# EAGLE design thermometer (EAGLE 5.12)
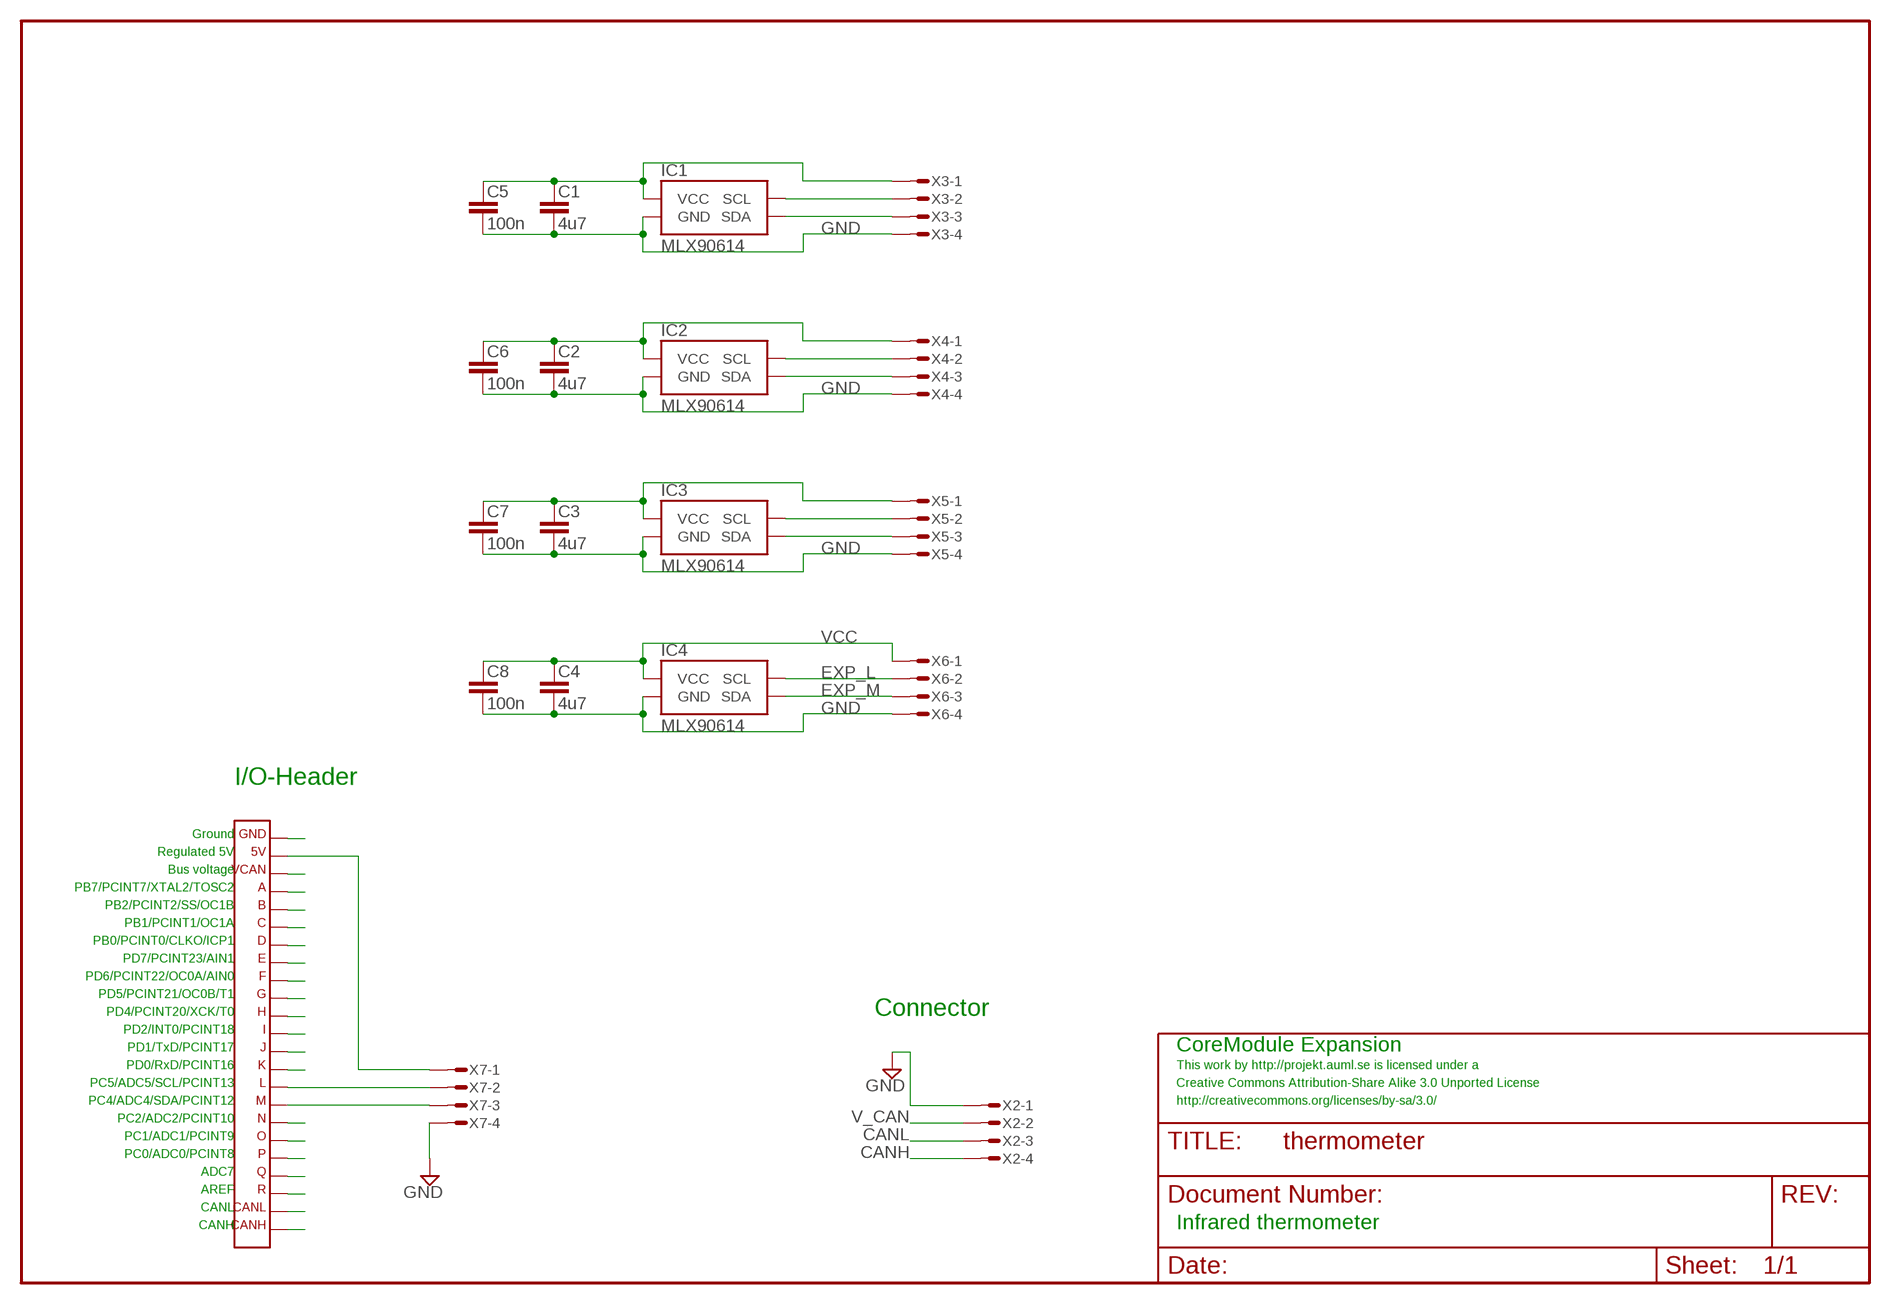
[diagram p0: schematic, sheet 1]

## Parts
C1  4u7  C-EUC0805  [C0805]
C2  4u7  C-EUC0805  [C0805]
C3  4u7  C-EUC0805  [C0805]
C4  4u7  C-EUC0805  [C0805]
C5  100n  C-EUC0603  [C0603]
C6  100n  C-EUC0603  [C0603]
C7  100n  C-EUC0603  [C0603]
C8  100n  C-EUC0603  [C0603]
IC1  MLX90614  MLX90614T=-39-4  [TO-39-4]
IC2  MLX90614  MLX90614T=-39-4  [TO-39-4]
IC3  MLX90614  MLX90614T=-39-4  [TO-39-4]
IC4  MLX90614  MLX90614T=-39-4  [TO-39-4]
X1  CORETWO_LAYOUTISPHOLES_CU  [CORETWO_LAYOUT_ISPHOLES_CU]
X2  MICROMATCH-4  [MICROMATCH-4]
X3  MICROMATCH-4  [MICROMATCH-4]
X4  MICROMATCH-4  [MICROMATCH-4]
X5  MICROMATCH-4  [MICROMATCH-4]
X6  MICROMATCH-4  [MICROMATCH-4]
X7  MICROMATCH-4  [MICROMATCH-4]

## Nets
CANH: X1.CANH X2.4
CANL: X1.CANL X2.3
EXP_A: X1.A
EXP_B: X1.B
EXP_C: X1.C
EXP_D: X1.D
EXP_E: X1.E
EXP_F: X1.F
EXP_G: X1.G
EXP_H: X1.H
EXP_I: X1.I
EXP_J: X1.J
EXP_K: X1.K
EXP_L: IC4.1(SCL) X1.L X6.2 X7.2
EXP_M: IC4.2(SDA) X1.M X6.3 X7.3
EXP_N: X1.N
EXP_O: X1.O
EXP_P: X1.P
EXP_Q: X1.Q
EXP_R: X1.R
GND: C1.2 C2.2 C3.2 C4.2 C5.2 C6.2 C7.2 C8.2 IC1.4(GND) IC2.4(GND) IC3.4(GND) IC4.4(GND) X1.GND X2.1 X3.4 X4.4 X5.4 X6.4 X7.4
N$1: C1.1 C5.1 IC1.3(VCC) X3.1
N$3: C2.1 C6.1 IC2.3(VCC) X4.1
N$5: C3.1 C7.1 IC3.3(VCC) X5.1
N$10: IC3.1(SCL) X5.2
N$11: IC3.2(SDA) X5.3
N$14: IC2.1(SCL) X4.2
N$15: IC2.2(SDA) X4.3
N$20: IC1.1(SCL) X3.2
N$21: IC1.2(SDA) X3.3
V_CAN: X1.VCAN X2.2
VCC: C4.1 C8.1 IC4.3(VCC) X1.5V X6.1 X7.1

## Notes on the sheet
- I/O-Header
- Ground
- Regulated 5V
- Bus voltage
- PB7/PCINT7/XTAL2/TOSC2
- PB2/PCINT2/SS/OC1B
- PB1/PCINT1/OC1A
- PB0/PCINT0/CLKO/ICP1
- PD7/PCINT23/AIN1
- PD6/PCINT22/OC0A/AIN0
- PD5/PCINT21/OC0B/T1
- PD4/PCINT20/XCK/T0 | Connector
- PD2/INT0/PCINT18
- PD1/TxD/PCINT17 | CoreModule Expansion
- PD0/RxD/PCINT16 | This work by http://projekt.auml.se is licensed under a
- PC5/ADC5/SCL/PCINT13 | Creative Commons Attribution-Share Alike 3.0 Unported License
- PC4/ADC4/SDA/PCINT12 | http://creativecommons.org/licenses/by-sa/3.0/
- PC2/ADC2/PCINT10
- PC1/ADC1/PCINT9
- PC0/ADC0/PCINT8
- ADC7
- AREF
- CANL
- CANH | Infrared thermometer

## Library data of the parts
C1-C8 = rcl:C-EU
IC1-IC4 = mlx90614:MLX90614: Infra Red Thermometer
X1 = expboard:CORETWO_LAYOUT
X2-X7 = con-amp-micromatch:MICROMATCH-4: MicroMaTch 4 7-215464-4 / 0-215464-4 Drawing Number C-215464 DDEController.pdf

## Board
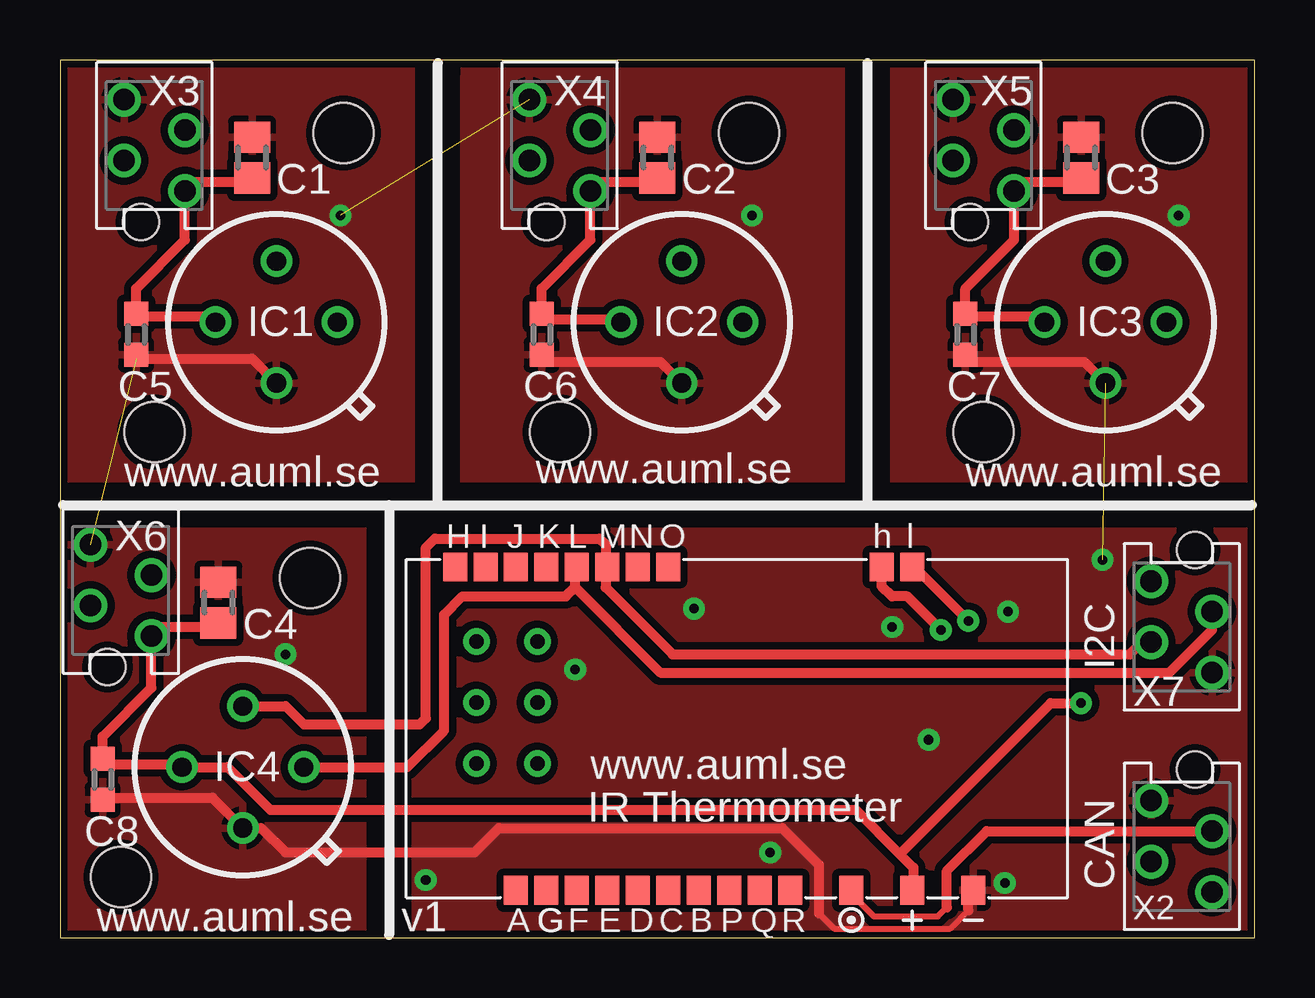
[diagram p1: board, top side]
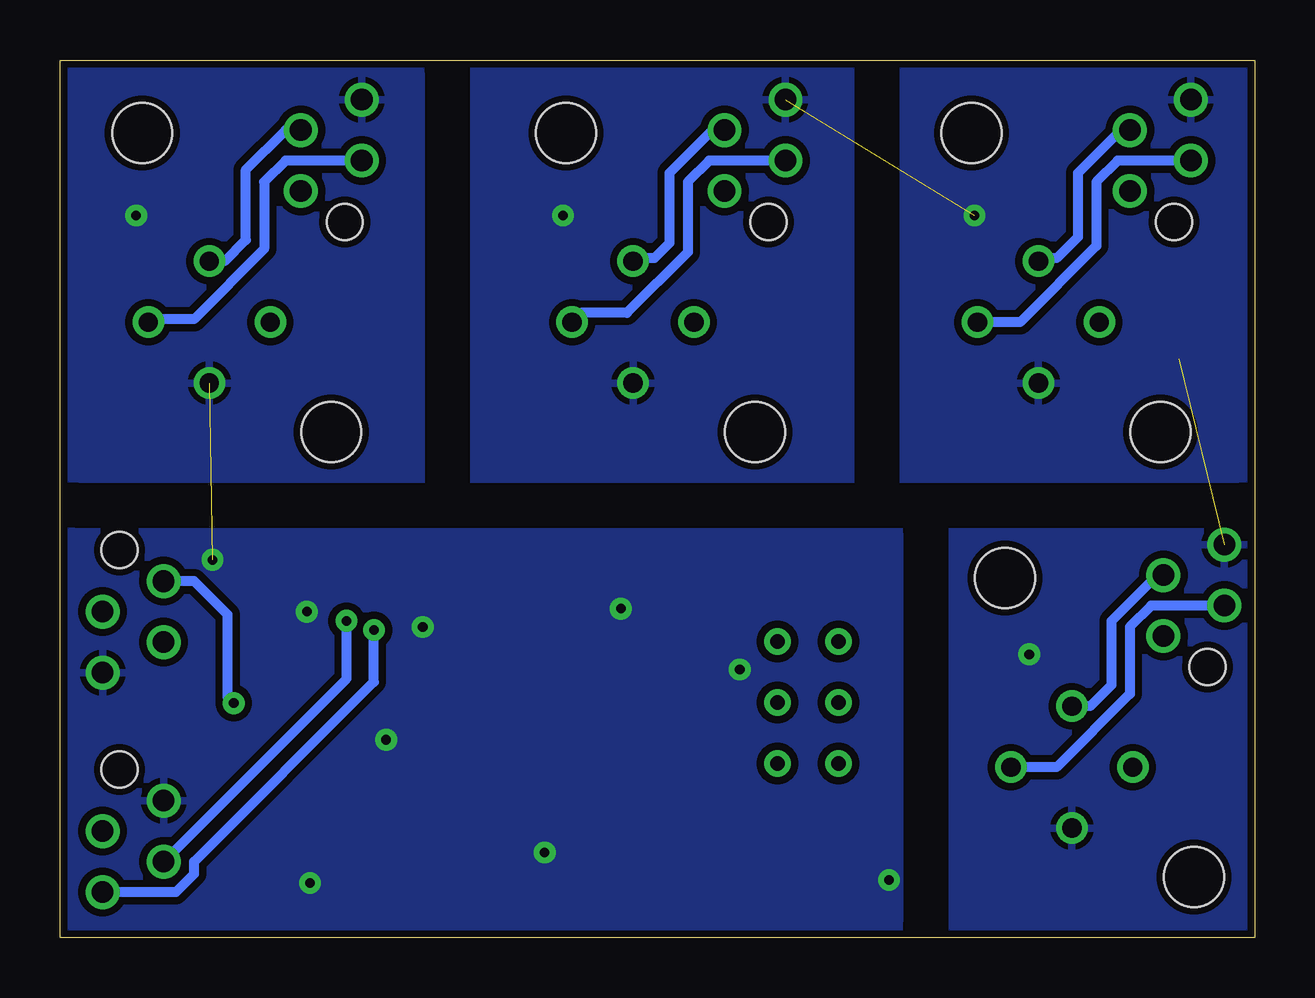
[diagram p2: board, bottom side, seen from below]

Size 49.78 x 36.58 mm. Coordinates in mm from the lower left corner, seen from the top.
Outline: 0,0 49.78,0 49.78,36.58 0,36.58 0,0
Copper layers (1*16): Top 0.035mm / dielectric 1.5mm / Bottom 0.035mm
Design rules "default *": minimum track width 10mil, minimum drill 0.4mm, track to track 10mil, track to pad 10mil, pad to pad 10mil, via to via 10mil, smd to smd 8mil, copper to edge 10mil, drill to drill 8mil, minimum pad ring 10mil, minimum via ring 10mil, stop-mask expansion 4mil, vias tented up to drill 18mil, thermal gap 10mil
Holes 2.5 mm at 10.41,14.99 2.54,2.54 3.94,21.08 11.81,33.53 20.83,21.08 28.7,33.53 38.48,21.08 46.35,33.53
tRestrict: 5 lines
bRestrict: 4 lines

### Footprints (pad centres in the part's own frame; a part is rotated, then mirrored left to right if it is on the bottom)
C0805 = smd 1.3 x 1.5: 1 -0.85,0; 2 0.85,0
C0603 = smd 1 x 1: 1 -0.85,0; 2 0.85,0
TO-39-4 = drill 0.8 round: 1 2.54,0; 2 0,2.54; 3 -2.54,0; 4 0,-2.54
CORETWO_LAYOUT_ISPHOLES_CU = smd 1 x 1.2: 5V 7.315,-6.648; A -9.195,-6.648; B -1.575,-6.648; C -2.845,-6.648; CANH 6.045,6.814; CANL 7.315,6.814; D -4.115,-6.648; E -5.385,-6.648; F -6.655,-6.648; G -7.925,-6.648; GND 9.855,-6.648; H -11.735,6.814; I -10.465,6.814; J -9.195,6.814; K -7.925,6.814; L -6.655,6.814; M -5.385,6.814; N -4.115,6.814; O -2.845,6.814; P -0.305,-6.648; Q 0.965,-6.648; R 2.235,-6.648; VCAN 4.775,-6.648 | drill 0.6 round: P$1 -10.846,3.708; P$2 -8.306,3.708; P$3 -10.846,1.168; P$4 -8.306,1.168; P$5 -8.306,-1.372; P$6 -10.846,-1.372
MICROMATCH-4 = drill 0.9 round: 1 1.905,1.27; 2 0.635,-1.27; 3 -0.635,1.27; 4 -1.905,-1.27 | hole 1.5: 3.199,-0.562

### Placement (x,y rotation side)
C1  8,32.51 90 top
C2  24.89,32.51 90 top
C3  42.55,32.51 90 top
C4  6.6,13.97 90 top
C5  3.17,25.15 270 top
C6  20.07,25.15 270 top
C7  37.72,25.15 270 top
C8  1.78,6.6 270 top
IC1  9.02,25.65 0 top
IC2  25.91,25.65 0 top
IC3  43.56,25.65 0 top
IC4  7.62,7.11 0 top
X1  28.19,8.64 0 top
X2  46.74,3.81 90 top
X3  3.94,33.02 270 top
X4  20.83,33.02 270 top
X5  38.48,33.02 270 top
X6  2.54,14.48 270 top
X7  46.74,12.95 90 top

### Tracks (layer width: path | path; a pad name or v marks a point on that pad's centre or on a via)
CANH  (via drill 0.4)
  Top 0.406: v36.7,12.83 35.31,14.22 34.67,14.22 34.24,14.66 X1.CANH
  Bottom 0.406: X2.4 44.96,1.91 44.2,2.67 44.2,3.17 36.7,10.67 v36.7,12.83
CANL  (via drill 0.4)
  Top 0.406: v37.85,13.21 35.6,15.45 X1.CANL
  Bottom 0.406: X2.3 37.85,10.79 v37.85,13.21
EXP_L
  Top 0.406: 10.03,7.24 IC4.1 14.48,7.11 16,8.64 16,13.46 16.76,14.22 21.08,14.22 21.46,14.61 | 21.46,14.61 21.46,15.37 X1.L | X7.2 48.01,12.83 46.23,11.05 25.02,11.05 21.46,14.61
  Bottom 0.406: X6.2 4.32,13.84 5.21,12.95 5.21,10.16 8.26,7.11 IC4.1
EXP_M
  Top 0.406: IC4.2 9.4,9.65 10.16,8.89 14.99,8.89 15.24,9.14 15.24,16.26 15.62,16.64 22.48,16.64 22.73,16.38 22.73,15.53 X1.M 22.73,15.37 22.73,14.61 25.53,11.81 44.58,11.81 45.09,12.32 X7.3
  Bottom 0.406: X6.3 4.06,15.11 5.97,13.21 5.97,10.54 6.86,9.65 IC4.2
GND  (via drill 0.4)  (3 unrouted)
  Top 0.254: 31.62,1.02 32.26,0.38 37.08,0.38 37.85,1.14
  Top 0.406: C8.2 1.69,5.75 1.78,5.84 6.35,5.84 IC4.4 8.38,4.57 9.4,3.56 17.27,3.56 18.29,4.57 30.1,4.57 31.62,3.05 31.62,1.02 | 37.85,1.14 37.85,1.78 X1.GND | C7.2 37.55,24.3 37.85,24 42.67,24 IC3.4 | C6.2 19.94,24.26 20.19,24 25.02,24 IC2.4 | C5.2 3.17,24.13 8,24.13 IC1.4
  other vias: 39.37,2.29 36.2,8.26 26.42,13.72 34.67,12.95 39.5,13.59 43.43,15.75 29.59,3.56 15.24,2.41 21.46,11.18 11.68,30.1 28.83,30.1 46.61,30.1 9.4,11.81
  pour Bottom (isolate 0.305, rank 3): 0,36.58 49.78,36.58 49.78,0 0,0
  pour Top (isolate 0.305, rank 3): 0,36.58 49.78,36.58 49.78,0 0,0
N$1
  Top 0.406: IC1.3 6.48,25.91 3.17,25.91 C5.1 3.17,27.05 5.21,29.08 X3.1 5.21,31.24 5.46,31.5 7.83,31.5 C1.1
N$3
  Top 0.406: IC2.3 23.24,25.78 20.03,25.78 C6.1 20.07,27.05 22.1,29.08 X4.1 22.48,31.5 24.73,31.5 C2.1
N$5
  Top 0.406: IC3.3 40.77,25.91 37.72,25.91 37.63,26 C7.1 37.72,27.05 39.75,29.08 X5.1 39.88,31.11 40.26,31.5 42.38,31.5 C3.1
N$10
  Bottom 0.406: X5.2 40.39,32.38 41.27,31.5 41.27,28.7 44.2,25.78 45.97,25.78 IC3.1
N$11
  Bottom 0.406: X5.3 40.39,33.66 42.04,32 42.04,29.08 42.93,28.19 IC3.2
N$14
  Bottom 0.406: X4.2 22.73,32.38 23.62,31.5 23.62,28.57 26.16,26.04 28.07,26.04 IC2.1
N$15
  Bottom 0.406: X4.3 22.61,33.66 24.38,31.88 24.38,28.96 25.02,28.32 25.78,28.32 IC2.2
N$20
  Bottom 0.406: X3.2 5.71,32.38 6.6,31.5 6.6,28.83 9.78,25.65 IC1.1
N$21
  Bottom 0.406: X3.3 5.59,33.66 7.37,31.88 7.37,29.21 8.26,28.32 8.89,28.32 IC1.2
V_CAN
  Top 0.254: X1.VCAN 32.97,1.57 33.02,1.52 33.27,1.52 33.91,0.89 36.58,0.89 36.96,1.27
  Top 0.406: 36.96,1.27 36.96,2.79 38.61,4.45 X2.2
VCC  (via drill 0.4)
  Top 0.406: 34.99,3.49 33.15,5.33 8.76,5.33 6.99,7.11 IC4.3 4.95,7.24 1.91,7.24 1.69,7.45 C8.1 1.78,8.38 3.81,10.41 X6.1 3.81,12.95 6.6,12.95 C4.1 | 34.99,3.49 35.56,2.92 35.56,2.04 X1.5V | v42.55,9.78 41.27,9.78 34.99,3.49
  Bottom 0.406: X7.1 44.2,14.86 42.8,13.46 42.8,10.03 v42.55,9.78

### Text on the board
tPlace: www.auml.se | www.auml.se | www.auml.se | I2C | www.auml.se | IR Thermometer | CAN | www.auml.se | v1
Document: Creative Commons Attribution-Share Alike 3.0 Unported License | This work by http://projekt.auml.se is licensed under a | http://creativecommons.org/licenses/by-sa/3.0/